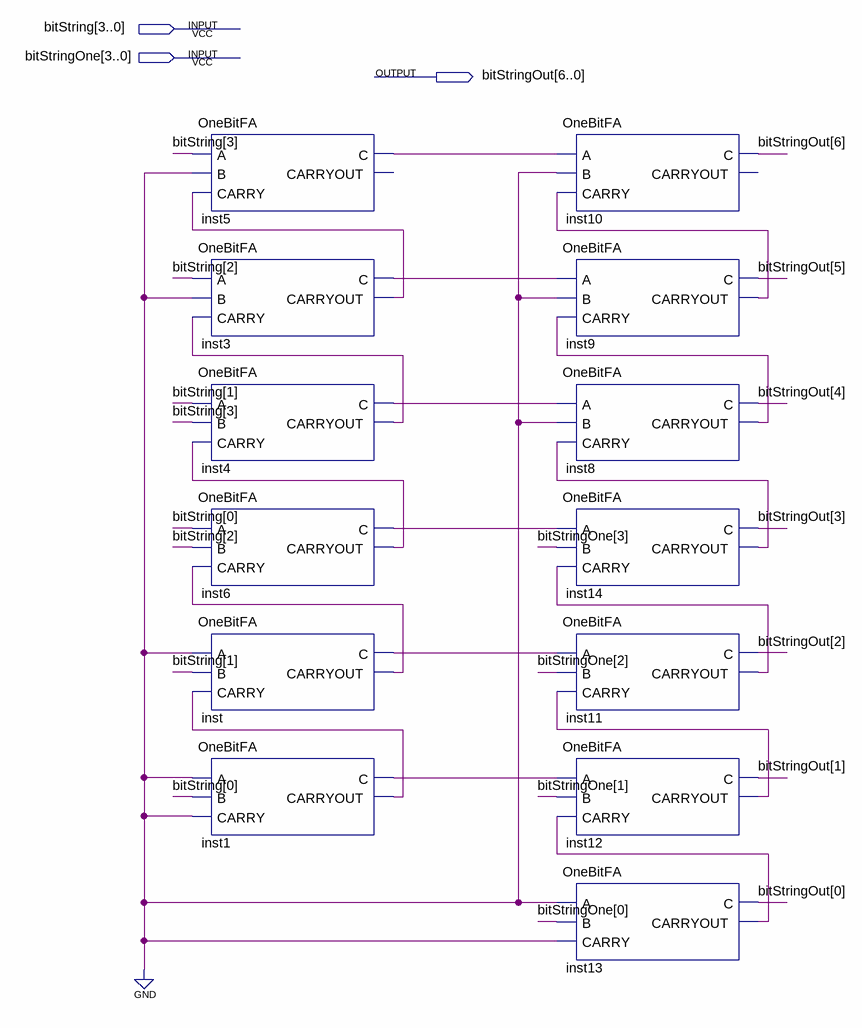
[diagram p0: schematic sheet]
// Quartus schematic switchToAdress.bdf as structural Verilog: 13 symbols, 3 pins
module switchToAdress (
  input  [3:0] bitString,
  input  [3:0] bitStringOne,
  output [6:0] bitStringOut
);

  wire inst1_c, inst1_carryout, inst3_c, inst3_carryout, inst4_c, inst4_carryout, inst5_c, inst6_c,
       inst6_carryout, inst8_carryout, inst9_carryout, inst11_carryout, inst12_carryout, inst13_carryout,
       inst14_carryout, inst_c, inst_carryout;

  OneBitFA inst5 (.A(bitString[3]), .B(1'b0), .CARRY(inst3_carryout), .C(inst5_c));  // open: CARRYOUT
  OneBitFA inst3 (.A(bitString[2]), .B(1'b0), .CARRY(inst4_carryout), .C(inst3_c), .CARRYOUT(inst3_carryout));
  OneBitFA inst4 (.A(bitString[1]), .B(bitString[3]), .CARRY(inst6_carryout), .C(inst4_c), .CARRYOUT(inst4_carryout));
  OneBitFA inst6 (.A(bitString[0]), .B(bitString[2]), .CARRY(inst_carryout), .C(inst6_c), .CARRYOUT(inst6_carryout));
  OneBitFA inst (.A(1'b0), .B(bitString[1]), .CARRY(inst1_carryout), .C(inst_c), .CARRYOUT(inst_carryout));
  OneBitFA inst1 (.A(1'b0), .B(bitString[0]), .CARRY(1'b0), .C(inst1_c), .CARRYOUT(inst1_carryout));
  OneBitFA inst10 (.A(inst5_c), .B(1'b0), .CARRY(inst9_carryout), .C(bitStringOut[6]));  // open: CARRYOUT
  OneBitFA inst9 (.A(inst3_c), .B(1'b0), .CARRY(inst8_carryout), .C(bitStringOut[5]), .CARRYOUT(inst9_carryout));
  OneBitFA inst8 (.A(inst4_c), .B(1'b0), .CARRY(inst14_carryout), .C(bitStringOut[4]), .CARRYOUT(inst8_carryout));
  OneBitFA inst14 (
    .A(inst6_c), .B(bitStringOne[3]), .CARRY(inst11_carryout), .C(bitStringOut[3]), .CARRYOUT(inst14_carryout));
  OneBitFA inst11 (
    .A(inst_c), .B(bitStringOne[2]), .CARRY(inst12_carryout), .C(bitStringOut[2]), .CARRYOUT(inst11_carryout));
  OneBitFA inst12 (
    .A(inst1_c), .B(bitStringOne[1]), .CARRY(inst13_carryout), .C(bitStringOut[1]), .CARRYOUT(inst12_carryout));
  OneBitFA inst13 (.A(1'b0), .B(bitStringOne[0]), .CARRY(1'b0), .C(bitStringOut[0]), .CARRYOUT(inst13_carryout));
endmodule
